# Altium schematic sheet 10M_PPS_OUT.SchDoc
size A4; SheetNumber: 18; SheetTotal: 18
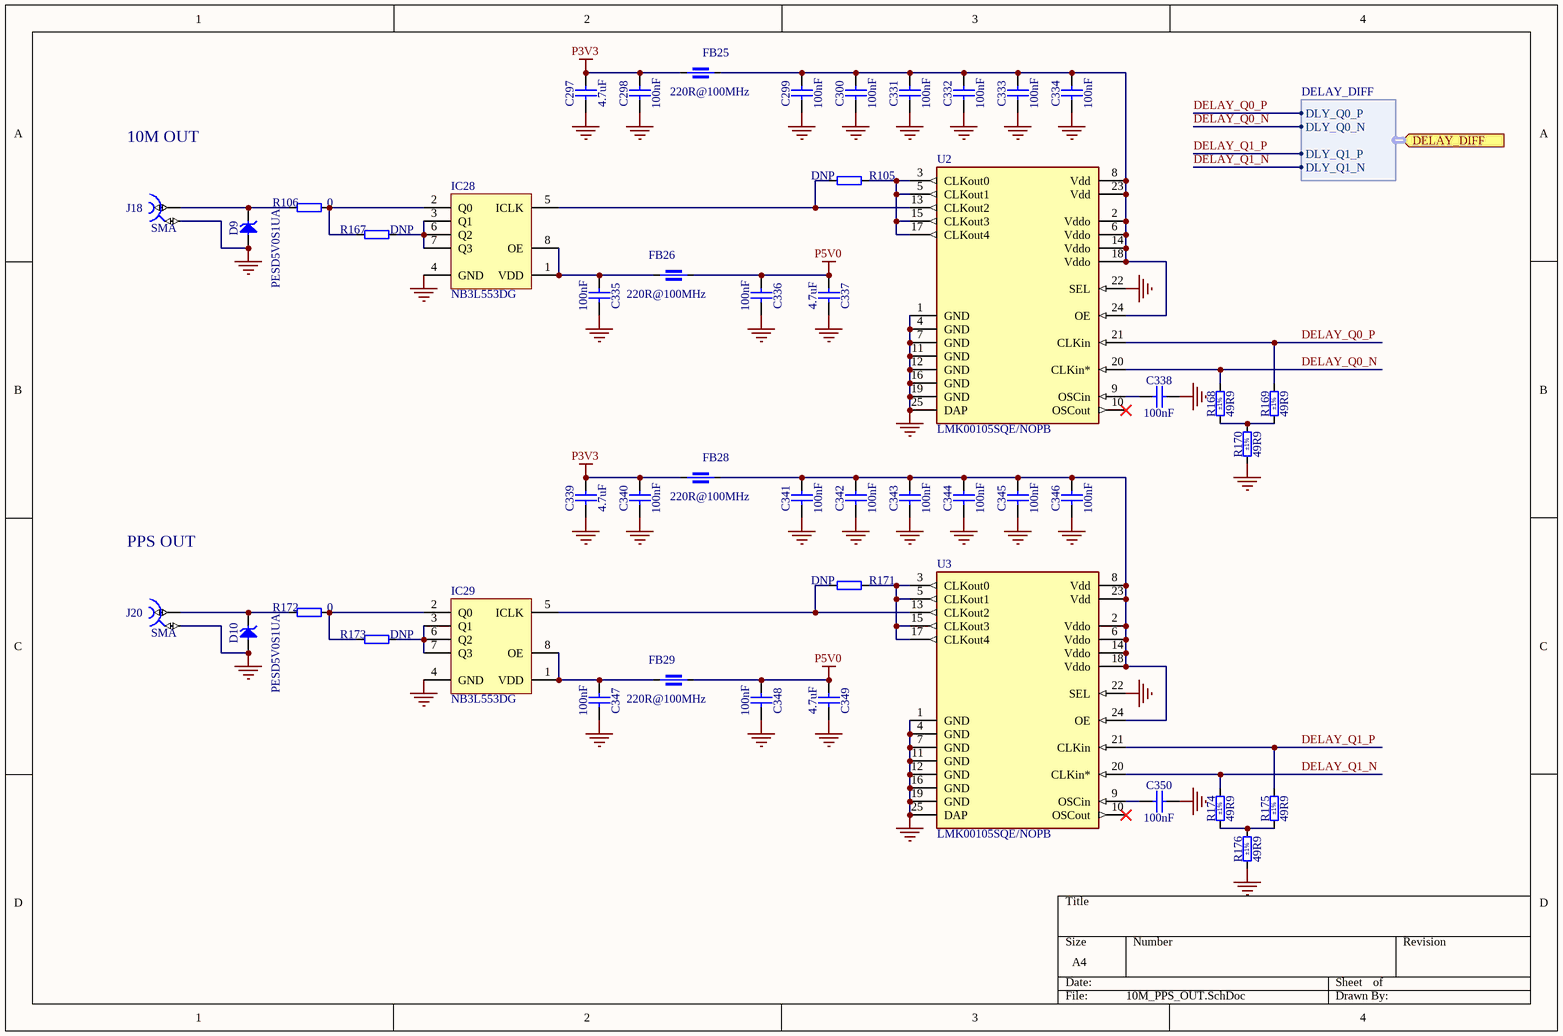
[diagram p0: 10M_PPS_OUT.SchDoc]

## Parts
C297  4.7uF  [CAPC1005X55N]
C298  100nF  [CAPC0603X33N]
C299  100nF  [CAPC0603X33N]
C300  100nF  [CAPC0603X33N]
C331  100nF  [CAPC0603X33N]
C332  100nF  [CAPC0603X33N]
C333  100nF  [CAPC0603X33N]
C334  100nF  [CAPC0603X33N]
C335  100nF  [CAPC0603X33N]
C336  100nF  [CAPC0603X33N]
C337  4.7uF  [CAPC1005X55N]
C338  100nF  [CAPC0603X33N]
C339  4.7uF  [CAPC1005X55N]
C340  100nF  [CAPC0603X33N]
C341  100nF  [CAPC0603X33N]
C342  100nF  [CAPC0603X33N]
C343  100nF  [CAPC0603X33N]
C344  100nF  [CAPC0603X33N]
C345  100nF  [CAPC0603X33N]
C346  100nF  [CAPC0603X33N]
C347  100nF  [CAPC0603X33N]
C348  100nF  [CAPC0603X33N]
C349  4.7uF  [CAPC1005X55N]
C350  100nF  [CAPC0603X33N]
D9  PESD5V0S1UA  [SOD2512X110N]
D10  PESD5V0S1UA  [SOD2512X110N]
FB25  220R@100MHz  [INDC1608X95N]
FB26  220R@100MHz  [INDC1608X95N]
FB28  220R@100MHz  [INDC1608X95N]
FB29  220R@100MHz  [INDC1608X95N]
IC28  NB3L553DG  [SOIC127P600X175-8N]
IC29  NB3L553DG  [SOIC127P600X175-8N]
J18  SMA  [HUBER-SUHNER_85_SMA-50-0-101/111_NE]
J20  SMA  [HUBER-SUHNER_85_SMA-50-0-101/111_NE]
R105  DNP  [RESC1005X40N]  (no BOM)
R106  0  [RESC1005X40N]
R167  DNP  [RESC1005X40N]  (no BOM)
R168  49R9  Tolerance: ±1%  [RESC1005X40N]
R169  49R9  Tolerance: ±1%  [RESC1005X40N]
R170  49R9  Tolerance: ±1%  [RESC1005X40N]
R171  DNP  [RESC1005X40N]  (no BOM)
R172  0  [RESC1005X40N]
R173  DNP  [RESC1005X40N]  (no BOM)
R174  49R9  Tolerance: ±1%  [RESC1005X40N]
R175  49R9  Tolerance: ±1%  [RESC1005X40N]
R176  49R9  Tolerance: ±1%  [RESC1005X40N]
U2  LMK00105SQE/NOPB  [FP-RTW0024A-MFG]
U3  LMK00105SQE/NOPB  [FP-RTW0024A-MFG]

## Ports
DELAY_DIFF (in, harness DELAY_DIFF, see SPEC-A7-TOP[1A], DIFF_DELAY_FANOUT[7B])

## Harnesses
DELAY_DIFF: DLY_Q0_P, DLY_Q0_N, DLY_Q1_P, DLY_Q1_N

## Nets
GND: C297.1 C298.1 C299.1 C300.1 C331.1 C332.1 C333.1 C334.1 C335.1 C336.1 C337.1 C338.2 C339.1 C340.1 C341.1 C342.1 C343.1 C344.1 C345.1 C346.1 C347.1 C348.1 C349.1 C350.2 D9.2(A) D10.2(A) IC28.4(GND) IC29.4(GND) J18.2 J20.2 R170.1 R176.1 U2.1(GND) U2.4(GND) U2.7(GND) U2.11(GND) U2.12(GND) U2.16(GND) U2.19(GND) U2.22(SEL) U2.25(DAP) U3.1(GND) U3.4(GND) U3.7(GND) U3.11(GND) U3.12(GND) U3.16(GND) U3.19(GND) U3.22(SEL) U3.25(DAP)
P3V3: C297.2 C298.2 C339.2 C340.2 FB25.1 FB28.1
P5V0: C336.2 C337.2 C348.2 C349.2 FB26.1 FB29.1
DELAY_Q0_N: R168.2 U2.20(CLKin*) ; port DELAY_DIFF.DLY_Q0_N
DELAY_Q0_P: R169.2 U2.21(CLKin) ; port DELAY_DIFF.DLY_Q0_P
DELAY_Q1_N: R174.2 U3.20(CLKin*) ; port DELAY_DIFF.DLY_Q1_N
DELAY_Q1_P: R175.2 U3.21(CLKin) ; port DELAY_DIFF.DLY_Q1_P
NetC299_2: C299.2 C300.2 C331.2 C332.2 C333.2 C334.2 FB25.2 U2.2(Vddo) U2.6(Vddo) U2.8(Vdd) U2.14(Vddo) U2.18(Vddo) U2.23(Vdd) U2.24(OE)
NetC335_2: C335.2 FB26.2 IC28.1(VDD) IC28.8(OE)
NetC338_1: C338.1 U2.9(OSCin)
NetC341_2: C341.2 C342.2 C343.2 C344.2 C345.2 C346.2 FB28.2 U3.2(Vddo) U3.6(Vddo) U3.8(Vdd) U3.14(Vddo) U3.18(Vddo) U3.23(Vdd) U3.24(OE)
NetC347_2: C347.2 FB29.2 IC29.1(VDD) IC29.8(OE)
NetC350_1: C350.1 U3.9(OSCin)
NetD9_1: D9.1(C) J18.1 R106.1
NetD10_1: D10.1(C) J20.1 R172.1
NetIC28_2: IC28.2(Q0) R106.2 R167.1
NetIC28_3: IC28.3(Q1) IC28.6(Q2) IC28.7(Q3) R167.2
NetIC28_5: IC28.5(ICLK) R105.2 U2.13(CLKout2)
NetIC29_2: IC29.2(Q0) R172.2 R173.1
NetIC29_3: IC29.3(Q1) IC29.6(Q2) IC29.7(Q3) R173.2
NetIC29_5: IC29.5(ICLK) R171.2 U3.13(CLKout2)
NetR105_1: R105.1 U2.3(CLKout0) U2.5(CLKout1) U2.15(CLKout3) U2.17(CLKout4)
NetR168_1: R168.1 R169.1 R170.2
NetR171_1: R171.1 U3.3(CLKout0) U3.5(CLKout1) U3.15(CLKout3) U3.17(CLKout4)
NetR174_1: R174.1 R175.1 R176.2

Not connected (* = marked no-connect by the designer): U2 10(OSCout)*; U3 10(OSCout)*

## Notes on the sheet
- 10M OUT
- PPS OUT

## Library data of the parts
C297 C337 C339 C349 = CC0402_4.7UF_6.3V_20%_X5R: Non-polarised capacitor; Part Description: SMD Multilayer Chip Ceramic Capacitor; Manufacturer: GENERIC; Manufacturer1 Part Number: C1005X5R0J475M050BC; Voltage: 6.3V; TC: X5R; Tolerance: ±20%; Part Number: CC0402_4.7UF_6.3V_20%_X5R; Component Kind: Standard; Component Type: Standard; Pin Count: 2; Value: 4.7uF; Status: Preferred; Manufacturer Part Number: CC0402_4.7UF_6.3V_20%_X5R; Case: 0402; Mounted: Yes; Socket: No; SMD: Yes; Sense: No; Manufacturer1 Example: TDK; Manufacturer1 ComponentHeight: 0.65mm; HelpURL: \\cern.ch\dfs\Applications\Altium\Datasheets\CC0402_X5R_TDK_C.pdf; Author: CERN DEM JLC; CreateDate: 03.03.2015; LatestRevisionDate: 03.03.2015
C298-C300 C331-C336 C338 C340-C348 C350 = CC0201_100NF_6.3V_10%_X5R: Non-polarised capacitor; Part Description: SMD Multilayer Chip Ceramic Capacitor; Manufacturer: GENERIC; Manufacturer1 Part Number: 02016D104KAT2A; Voltage: 6.3V; TC: X5R; Tolerance: ±10%; Part Number: CC0201_100NF_6.3V_10%_X5R; Component Kind: Standard; Component Type: Standard; Pin Count: 2; Value: 100nF; Status: Not Recommended; Manufacturer Part Number: CC0201_100NF_6.3V_10%_X5R; Case: 0201; Mounted: Yes; Socket: No; SMD: Yes; Sense: No; Manufacturer1 Example: AVX; Manufacturer1 ComponentHeight: 0.33mm; HelpURL: \\cern.ch\dfs\Applications\Altium\Datasheets\CC0201_X5R_AVX.pdf; Author: CERN DEM JLC; CreateDate: 03.12.2007; LatestRevisionDate: 03.12.2007
D9 D10 = PESD5V0S1UA: Transient Voltage Suppressor Diode (Uni-Directional); Part Description: Unidirectional ESD Protection for Transient Voltage Suppression; Manufacturer: NXP SEMICONDUCTORS; Voltage: 5V; Power: 890W; PressFit: No; Bonding: No; Part Number: PESD5V0S1UA; Component Kind: Standard; Component Type: Standard; Device: PESD5V0S1UA; PackageDescription: Small Outline Diode (SOD-323), 1.70mm W X 1.25mm L X 1.10mm H body,  IPC Medium Density; Manufacturer Part Number: PESD5V0S1UA; Pin Count: 2; Case: SOD-323; Mounted: Yes; Socket: No; SMD: Yes; Sense: No; ComponentHeight: 1.1mm; HelpURL: \\cern.ch\dfs\Applications\Altium\Datasheets\PESD5V0S1UA.pdf; Author: CERN DEM JLC; CreateDate: 28.08.2012; LatestRevisionDate: 18.09.2013
FB25 FB26 FB28 FB29 = IND0603_MURATA_BLM18SG221TN1: Part Description: SMD EMIFIL Suppression Chip Ferrite Bead; Manufacturer: MURATA; Tolerance: ±25%; Power: 2.5A; Resistance: 0.04R; Part Number: IND0603_MURATA_BLM18SG221TN1; Component Kind: Standard; Component Type: Standard; Pin Count: 2; Value: 220R@100MHz; Manufacturer Part Number: BLM18SG221TN1; Case: 0603; Mounted: Yes; Socket: No; SMD: Yes; Sense: No; ComponentHeight: 0.95mm; HelpURL: \\cern.ch\dfs\Applications\Altium\Datasheets\IND0603_MURATA_BLM18S.pdf; Author: CERN DEM MR; CreateDate: 08.01.2016; LatestRevisionDate: 25.10.2018
J18 J20 = HUBER-SUHNER_85_SMA-50-0-101/111_NE: Part Description: 50 Ohms SMA Right Angle PCB Jack; Manufacturer: HUBER+SUHNER; PressFit: No; Part Number: HUBER-SUHNER_85_SMA-50-0-101/111_NE; Component Kind: Standard; Component Type: Standard; Pin Count: 2; Family: SMA; Mounted: Yes; Socket: No; SMD: No; Sense: No; Status: None; Manufacturer Part Number: 85_SMA-50-0-101/111_NE; ComponentHeight: 9.6mm; HelpURL: \\cern.ch\dfs\Applications\Altium\Datasheets\HUBER-SUHNER_85_SMA-50-0-101-111_NE.pdf; Author: CERN DEM JLC; CreateDate: 20.04.2010; LatestRevisionDate: 06.11.2014
R105 R106 R167 R171-R173 = R0402_0R_JUMPER: Resistor; Part Description: 1A (0.05R Max DC Resistance) Zero Ohm Jumper; Manufacturer: GENERIC; Manufacturer1 Part Number: 232270591001L; PressFit: No; Part Number: R0402_0R_JUMPER; Component Type: Standard; Pin Count: 2; Status: Not Recommended; Manufacturer Part Number: R0402_0R_JUMPER; Case: 0402; Mounted: Yes; Sense: No; Socket: No; SMD: Yes; Manufacturer1 Example: YAGEO PHYCOMP; Manufacturer1 ComponentHeight: 0.4mm; HelpURL: \\cern.ch\dfs\Applications\Altium\Datasheets\R0402_Phycomp_RC0402.pdf; Author: CERN DEM JLC; CreateDate: 03.12.2007; LatestRevisionDate: 17.10.2012
  R105 R167 R171 R173: Value: DNP
  R106 R172: Component Kind: Standard; Value: 0
R168-R170 R174-R176 = R0402_49R9_1%_0.0625W_100PPM: Resistor - 1%; Part Description: General Purpose Thick Film Chip Resistor; Manufacturer: GENERIC; Manufacturer1 Part Number: 232270674999L or RC0402FR-0749R9L; TC: ±100ppm/°C; PressFit: No; Part Number: R0402_49R9_1%_0.0625W_100PPM; Component Kind: Standard; Component Type: Standard; Pin Count: 2; Value: 49R9; Status: Not Recommended; Power: 0.0625W; Manufacturer Part Number: R0402_49R9_1%_0.0625W_100PPM; Case: 0402; Mounted: Yes; Sense: No; Socket: No; SMD: Yes; Manufacturer1 Example: YAGEO PHYCOMP; Manufacturer1 ComponentHeight: 0.4mm; HelpURL: \\cern.ch\dfs\Applications\Altium\Datasheets\R0402_Phycomp_RC0402.pdf; Author: CERN DEM JLC; CreateDate: 24.10.2012; LatestRevisionDate: 24.10.2012
U2 U3 = CMP-04855-000022-1: IC CLK BUFFER 2:5 200MHZ 24WQFN; Max Supply Voltage: 3.45V; Number of Outputs: 5; Operating Supply Current: 25mA; Min Supply Voltage: 2.375V; Number of Circuits: 1; Radiation Hardening: No; Frequency: 200MHz; REACH SVHC: No SVHC; Min Operating Temperature: -40°C; Mount: Surface Mount; Number of Pins: 24; Package Quantity: 250; Max Operating Temperature: 85°C; Series: LMK00105; Lead Free: Lead Free; Packaging: Tape and Reel